# Altium schematic sheet io_0.schdoc
size 376 x 299 mm; Device: A_Customize; Symbol: A_Customize; Name: A_Customize; @Project Name: Odin; REV: 1.0; Date: 2024-10-02; Sheet: 1/1; Draw By: hsinr; Company: Your Company; Convert to PCB: yes; Add into BOM: yes; @Page No: 5; @Page Count: 9; @Schematic Name: Odin; @Board Name: Odin_V1.0.0; @Update Date: 2025-12-16; @Create Time: 19:52:40; @Update Time: 15:30:47; @Page Name: io_0; @Create Date: 2025-02-28
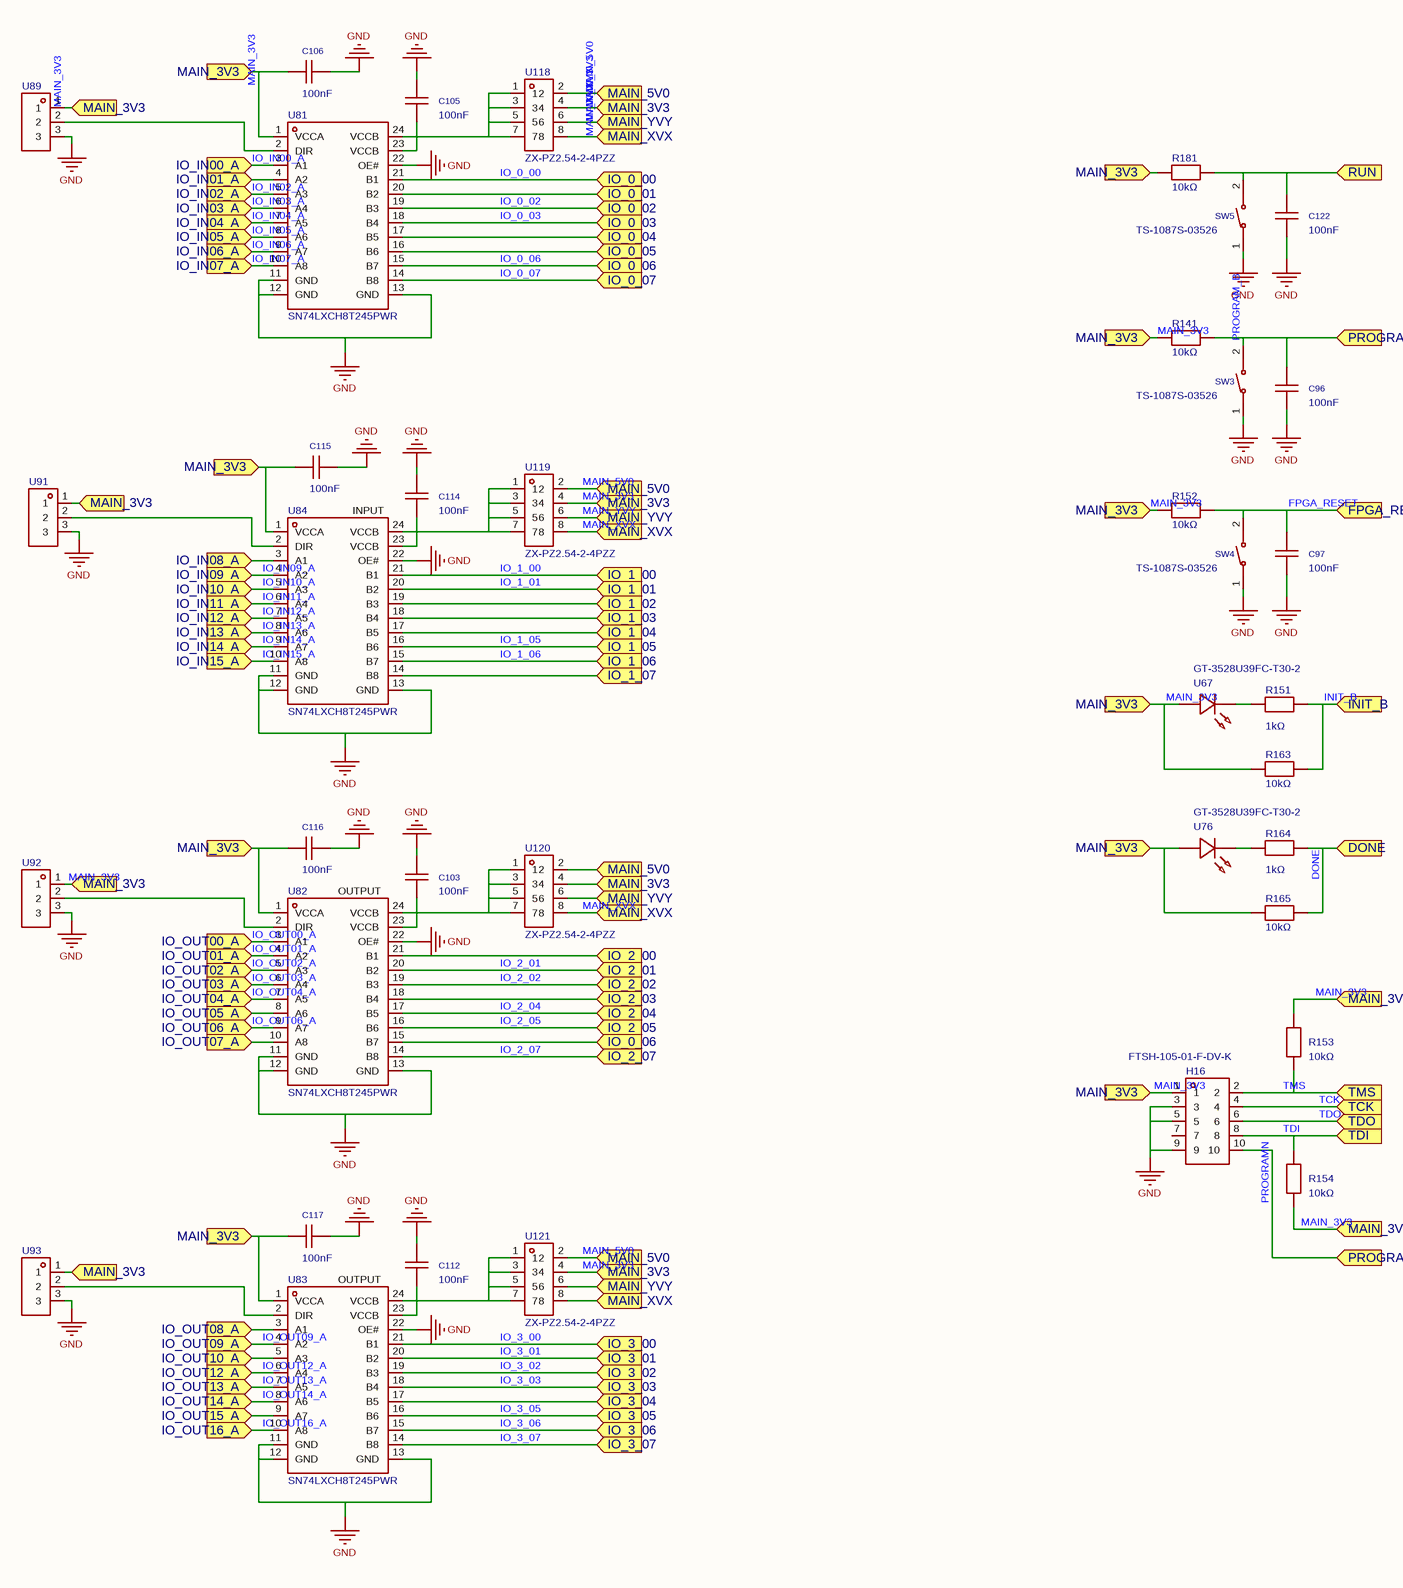
[diagram p0: io_0.schdoc]

## Parts
C96  100nF  [C0603]
C97  100nF  [C0603]
C103  100nF  [C0603]
C105  100nF  [C0603]
C106  100nF  [C0603]
C112  100nF  [C0603]
C114  100nF  [C0603]
C115  100nF  [C0603]
C116  100nF  [C0603]
C117  100nF  [C0603]
C122  100nF  [C0603]
H16  FTSH-105-01-F-DV-K  [HDR-SMD_FTSH-105-01-F-DV-K]
R141  10kΩ  [R0402]
R151  1kΩ  [R0402]
R152  10kΩ  [R0402]
R153  10kΩ  [R0402]
R154  10kΩ  [R0402]
R163  10kΩ  [R0402]
R164  1kΩ  [R0402]
R165  10kΩ  [R0402]
R181  10kΩ  [R0402]
SW3  TS-1087S-03526  [SW-SMD_L5.2-W5.2-P3.70-LS6.4]
SW4  TS-1087S-03526  [SW-SMD_L5.2-W5.2-P3.70-LS6.4]
SW5  TS-1087S-03526  [SW-SMD_L5.2-W5.2-P3.70-LS6.4]
U67  GT-3528U39FC-T30-2  [LED-SMD_L3.2-W3.0-LS3.5-RD_GT-3528U39FC-T30-2]
U76  GT-3528U39FC-T30-2  [LED-SMD_L3.2-W3.0-LS3.5-RD_GT-3528U39FC-T30-2]
U81  SN74LXCH8T245PWR  [TSSOP-24_L7.8-W4.4-P0.65-LS6.4-BL]
U82  SN74LXCH8T245PWR  [TSSOP-24_L7.8-W4.4-P0.65-LS6.4-BL]
U83  SN74LXCH8T245PWR  [TSSOP-24_L7.8-W4.4-P0.65-LS6.4-BL]
U84  SN74LXCH8T245PWR  [TSSOP-24_L7.8-W4.4-P0.65-LS6.4-BL]
U89  PH2.54-01-03PZD  [HDR-TH_3P-P2.54-V-M]  (value not drawn)
U91  PH2.54-01-03PZD  [HDR-TH_3P-P2.54-V-M]  (value not drawn)
U92  PH2.54-01-03PZD  [HDR-TH_3P-P2.54-V-M]  (value not drawn)
U93  PH2.54-01-03PZD  [HDR-TH_3P-P2.54-V-M]  (value not drawn)
U118  ZX-PZ2.54-2-4PZZ  [HDR-TH_8P-P2.54-V-M-R2-C4-S2.54]
U119  ZX-PZ2.54-2-4PZZ  [HDR-TH_8P-P2.54-V-M-R2-C4-S2.54]
U120  ZX-PZ2.54-2-4PZZ  [HDR-TH_8P-P2.54-V-M-R2-C4-S2.54]
U121  ZX-PZ2.54-2-4PZZ  [HDR-TH_8P-P2.54-V-M-R2-C4-S2.54]

## Ports
DONE (in), FPGA_RESET (in), INIT_B (in), IO_0_00 (in), IO_0_01 (in), IO_0_02 (in), IO_0_03 (in), IO_0_04 (in), IO_0_05 (in), IO_0_06 (in), IO_0_07 (in), IO_1_00 (in), IO_1_01 (in), IO_1_02 (in), IO_1_03 (in), IO_1_04 (in), IO_1_05 (in), IO_1_06 (in), IO_1_07 (in), IO_2_00 (in), IO_2_01 (in), IO_2_02 (in), IO_2_03 (in), IO_2_04 (in), IO_2_05 (in), IO_2_07 (in), IO_3_00 (in), IO_3_01 (in), IO_3_02 (in), IO_3_03 (in), IO_3_04 (in), IO_3_05 (in), IO_3_06 (in), IO_3_07 (in), IO_IN00_A (in), IO_IN01_A (in), IO_IN02_A (in), IO_IN03_A (in), IO_IN04_A (in), IO_IN05_A (in), IO_IN06_A (in), IO_IN07_A (in), IO_IN08_A (in), IO_IN09_A (in), IO_IN10_A (in), IO_IN11_A (in), IO_IN12_A (in), IO_IN13_A (in), IO_IN14_A (in), IO_IN15_A (in), IO_OUT00_A (in), IO_OUT01_A (in), IO_OUT02_A (in), IO_OUT03_A (in), IO_OUT04_A (in), IO_OUT05_A (in), IO_OUT06_A (in), IO_OUT07_A (in), IO_OUT08_A (in), IO_OUT09_A (in), IO_OUT10_A (in), IO_OUT12_A (in), IO_OUT13_A (in), IO_OUT14_A (in), IO_OUT15_A (in), IO_OUT16_A (in), MAIN_3V3 (in), MAIN_5V0 (in), MAIN_XVX (in), MAIN_YVY (in), PROGRAM_B (in), PROGRAMN (in), RUN (in), TCK (in), TDI (in), TDO (in), TMS (in)

## Nets
GND: C96.1 C97.1 C103.2 C105.2 C106.2 C112.2 C114.2 C115.2 C116.2 C117.2 C122.1 H16.3 H16.5 H16.9 SW3.1 SW4.1 SW5.1 U81.11(GND) U81.12(GND) U81.13(GND) U81.22(OE#) U82.11(GND) U82.12(GND) U82.13(GND) U82.22(OE#) U83.11(GND) U83.12(GND) U83.13(GND) U83.22(OE#) U84.11(GND) U84.12(GND) U84.13(GND) U84.22(OE#) U89.3 U91.3 U92.3 U93.3
DONE: R164.1 R165.1 ; port DONE
FPGA_RESET: C97.2 R152.2 SW4.2 ; port FPGA_RESET
INIT_B: R151.1 R163.1 ; port INIT_B
IO_0_00: U81.21(B1) ; port IO_0_00
IO_0_01: U81.20(B2) ; port IO_0_01
IO_0_02: U81.19(B3) ; port IO_0_02
IO_0_03: U81.18(B4) ; port IO_0_03
IO_0_04: U81.17(B5) ; port IO_0_04
IO_0_05: U81.16(B6) ; port IO_0_05
IO_0_06: U81.15(B7) U82.15(B7) ; port IO_0_06
IO_0_07: U81.14(B8) ; port IO_0_07
IO_1_00: U84.21(B1) ; port IO_1_00
IO_1_01: U84.20(B2) ; port IO_1_01
IO_1_02: U84.19(B3) ; port IO_1_02
IO_1_03: U84.18(B4) ; port IO_1_03
IO_1_04: U84.17(B5) ; port IO_1_04
IO_1_05: U84.16(B6) ; port IO_1_05
IO_1_06: U84.15(B7) ; port IO_1_06
IO_1_07: U84.14(B8) ; port IO_1_07
IO_2_00: U82.21(B1) ; port IO_2_00
IO_2_01: U82.20(B2) ; port IO_2_01
IO_2_02: U82.19(B3) ; port IO_2_02
IO_2_03: U82.18(B4) ; port IO_2_03
IO_2_04: U82.17(B5) ; port IO_2_04
IO_2_05: U82.16(B6) ; port IO_2_05
IO_2_07: U82.14(B8) ; port IO_2_07
IO_3_00: U83.21(B1) ; port IO_3_00
IO_3_01: U83.20(B2) ; port IO_3_01
IO_3_02: U83.19(B3) ; port IO_3_02
IO_3_03: U83.18(B4) ; port IO_3_03
IO_3_04: U83.17(B5) ; port IO_3_04
IO_3_05: U83.16(B6) ; port IO_3_05
IO_3_06: U83.15(B7) ; port IO_3_06
IO_3_07: U83.14(B8) ; port IO_3_07
IO_IN00_A: U81.3(A1) ; port IO_IN00_A
IO_IN01_A: U81.4(A2) ; port IO_IN01_A
IO_IN02_A: U81.5(A3) ; port IO_IN02_A
IO_IN03_A: U81.6(A4) ; port IO_IN03_A
IO_IN04_A: U81.7(A5) ; port IO_IN04_A
IO_IN05_A: U81.8(A6) ; port IO_IN05_A
IO_IN06_A: U81.9(A7) ; port IO_IN06_A
IO_IN07_A: U81.10(A8) ; port IO_IN07_A
IO_IN08_A: U84.3(A1) ; port IO_IN08_A
IO_IN09_A: U84.4(A2) ; port IO_IN09_A
IO_IN10_A: U84.5(A3) ; port IO_IN10_A
IO_IN11_A: U84.6(A4) ; port IO_IN11_A
IO_IN12_A: U84.7(A5) ; port IO_IN12_A
IO_IN13_A: U84.8(A6) ; port IO_IN13_A
IO_IN14_A: U84.9(A7) ; port IO_IN14_A
IO_IN15_A: U84.10(A8) ; port IO_IN15_A
IO_OUT00_A: U82.3(A1) ; port IO_OUT00_A
IO_OUT01_A: U82.4(A2) ; port IO_OUT01_A
IO_OUT02_A: U82.5(A3) ; port IO_OUT02_A
IO_OUT03_A: U82.6(A4) ; port IO_OUT03_A
IO_OUT04_A: U82.7(A5) ; port IO_OUT04_A
IO_OUT05_A: U82.8(A6) ; port IO_OUT05_A
IO_OUT06_A: U82.9(A7) ; port IO_OUT06_A
IO_OUT07_A: U82.10(A8) ; port IO_OUT07_A
IO_OUT08_A: U83.3(A1) ; port IO_OUT08_A
IO_OUT09_A: U83.4(A2) ; port IO_OUT09_A
IO_OUT10_A: U83.5(A3) ; port IO_OUT10_A
IO_OUT12_A: U83.6(A4) ; port IO_OUT12_A
IO_OUT13_A: U83.7(A5) ; port IO_OUT13_A
IO_OUT14_A: U83.8(A6) ; port IO_OUT14_A
IO_OUT15_A: U83.9(A7) ; port IO_OUT15_A
IO_OUT16_A: U83.10(A8) ; port IO_OUT16_A
MAIN_3V3: C106.1 C115.1 C116.1 C117.1 H16.1 R141.1 R152.1 R153.1 R154.2 R163.2 R165.2 R181.1 U67.1 U76.1 U81.1(VCCA) U82.1(VCCA) U83.1(VCCA) U84.1(VCCA) U89.1 U91.1 U92.1 U93.1 U118.4 U119.4 U120.4 U121.4 ; port MAIN_3V3
MAIN_5V0: U118.2 U119.2 U120.2 U121.2 ; port MAIN_5V0
MAIN_XVX: U118.8 U119.8 U120.8 U121.8 ; port MAIN_XVX
MAIN_YVY: U118.6 U119.6 U120.6 U121.6 ; port MAIN_YVY
PROGRAM_B: C96.2 R141.2 SW3.2 ; port PROGRAM_B
PROGRAMN: H16.10 ; port PROGRAMN
RUN: C122.2 R181.2 SW5.2 ; port RUN
TCK: H16.4 ; port TCK
TDI: H16.8 R154.1 ; port TDI
TDO: H16.6 ; port TDO
TMS: H16.2 R153.2 ; port TMS
NetC103_1: C103.1 U82.23(VCCB) U82.24(VCCB) U120.1 U120.3 U120.5 U120.7
NetC105_1: C105.1 U81.23(VCCB) U81.24(VCCB) U118.1 U118.3 U118.5 U118.7
NetC112_1: C112.1 U83.23(VCCB) U83.24(VCCB) U121.1 U121.3 U121.5 U121.7
NetC114_1: C114.1 U84.23(VCCB) U84.24(VCCB) U119.1 U119.3 U119.5 U119.7
NetR151_2: R151.2 U67.2
NetR164_2: R164.2 U76.2
NetU81_2: U81.2(DIR) U89.2
NetU82_2: U82.2(DIR) U92.2
NetU83_2: U83.2(DIR) U93.2
NetU84_2: U84.2(DIR) U91.2

Not connected (* = marked no-connect by the designer): H16 7

## Notes on the sheet
- (near U84) INPUT
- (near U82) OUTPUT
- (near U83) OUTPUT
- 1
- 2
- 3
- 4
- 5
- 6
- 7
- A
- B
- C
- D
- E
- TITLE:
- Odin
- Company:
- Your Company
- Sheet:
- REV:
- 1.0
- 1/1
- Date:
- 2024-10-02
- Drawn By:
- hsinr

## Library data of the parts
C96 C97 C103 C105 C106 C112 C114-C117 C122 = CL10B223KB8NNNC: Capacitance:22nF Tolerance:±10% Tolerance:±10% Voltage Rating:50V Temperature Coefficient:X7R; Manufacturer: SAMSUNG(三星); AddInBom: yes; ModelId: 624118aa3cc7497086c383c2d72e0852; ModelName: C0603_L1.6-W0.8-H0.8; ModelTransform: 62.992,31.496,0,0,0,0,0,0,0; Tolerance: ±10%; Voltage Rating: 50V; Temperature Coefficient: X7R; Symbol: CL10B223KB8NNNC; Value: 100nF; Device: CL10B223KB8NNNC; Supplier: LCSC; Manufacturer Part: CL10B223KB8NNNC; JLCPCB Part Class: Basic Part; LCSC Part Name: 22nF ±10% 50V; Supplier Footprint: 0603; Datasheet: https://item.szlcsc.com/datasheet/CL10B223KB8NNNC/21834.html; ConvertToPcb: yes; FootprintName: C0603
H16 = FTSH-105-01-F-DV-K: Pin Structure:2x5P Pitch:1.27mm Circluar Pins/Square Pins:Pin Header Mounting Type:Surface Mount,Vertical Number of Rows:2 Number of Pins:10P Length of Mating Pin:3.05mm Contact Material:Phosphor Bronze Contact Plating:Gold Operating Temperature:-55℃~+125; Manufacturer: SAMTEC; AddInBom: yes; Pin Structure: 2x5P; Pitch: 1.27mm; Symbol: FTSH-105-01-F-DV-K; Device: FTSH-105-01-F-DV-K; LCSC Part Name: 2x5P 间距:1.27mm 方针 立贴; SupplierPart: C5382952; ManufacturerPart: FTSH-105-01-F-DV-K; Supplier Footprint: SMD,P=1.27mm; JLCPCB Part Class: Extended Part; Datasheet: https://item.szlcsc.com/datasheet/FTSH-105-01-F-DV-K/6257093.html; Supplier: LCSC; ConvertToPcb: yes; FootprintName: HDR-SMD_FTSH-105-01-F-DV-K; Circluar Pins/Square Pins: Pin Header; Mounting Type: Surface Mount,Vertical; Number of Rows: 2; Number of Pins: 10P; Length of Mating Pin: 3.05mm; Contact Material: Phosphor Bronze; Contact Plating: Gold; Operating Temperature: -55℃~+125℃; Color: Black
R141 R151-R154 R163-R165 R181 = FRC0402F3002TS: Type:Thick Film Resistor Resistance:30kΩ Tolerance:±1% Tolerance:±1% Power(Watts):62.5mW Voltage-Supply(Max):50V Temperature Coefficient:±100ppm/℃ Temperature Coefficient:±100ppm/℃ Operating Temperature:-55℃~+155℃ Operating Temperature:-55℃~+155℃; Manufacturer: FOJAN(富捷); AddInBom: yes; ModelId: efdecb7dae4442949d28eecaf748420f; ModelName: R0402_L1.0-W0.5-H0.4; ModelTransform: 39.37,19.685,0,0,0,0,0,0,0; Tolerance: ±1%; Power(Watts): 62.5mW; Voltage-Supply(Max): 50V; Symbol: FRC0402F3002TS; Device: FRC0402F3002TS; LCSC Part Name: 30kΩ ±1% 62.5mW 厚膜电阻; ManufacturerPart: FRC0402F3002TS; Supplier Footprint: 0402; JLCPCB Part Class: Extended Part; Supplier: LCSC; ConvertToPcb: yes; FootprintName: R0402; Type: Thick Film Resistor; Temperature Coefficient: ±100ppm/℃; Operating Temperature: -55℃~+155℃
  R141 R152-R154 R163 R165 R181: Value: 10kΩ
  R151 R164: Value: 1kΩ
SW3-SW5 = TS-1087S-03526: Circuit:SPST Actuator Style:Round Button Mounting Style:Brick nogging Switch Length:5.2mm Switch Width:5.2mm Switch Height:3.5mm Contact Current:50mA Voltage Rating (DC):12V With Lamp:- Mechanical Life:-; Manufacturer: XUNPU(讯普); AddInBom: yes; ModelId: 2723734148c54955a536c213bd124217; ModelName: SW-SMD_L5.2-W5.2-H4.5-P3.70-LS6.4; ModelTransform: 251.968,204.724,0,0,0,0,0,0,0; Circuit: SPST; Switch Length: 5.2mm; Switch Height: 3.5mm; Contact Current: 50mA; Voltage Rating (DC): 12V; Symbol: TS-1087S-03526; Device: TS-1087S-03526; Supplier: LCSC; Supplier Part: C455271; Manufacturer Part: TS-1087S-03526; JLCPCB Part Class: Extended Part; LCSC Part Name: 5.2*5.2*3.5mm 立贴 轻触开关; Supplier Footprint: SMD,5.2x5.2mm; Datasheet: https://atta.szlcsc.com/upload/public/pdf/source/20191118/C455274_574AF48D0973B20F599903060160141E.pdf; ConvertToPcb: yes; FootprintName: SW-SMD_L5.2-W5.2-P3.70-LS6.4; Actuator Style: Round Button; Mounting Style: Brick nogging; Switch Width: 5.2mm; With Lamp: -; Mechanical Life: -
U67 U76 = GT-3528U39FC-T30-2: Illumination Color:Red Voltage - Forward(Vf):1.8V~2.4V Voltage - Forward(Vf):1.8V~2.4V Power(Watts):48mW Forward Current:20mA Wavelength - Dominant:618nm~627nm Wavelength - Dominant:618nm~627nm Diode Configuration:Discrete Diode Luminous Intensity:16000mc; Manufacturer: HONGLITRONIC(鸿利光电); AddInBom: yes; ModelId: 94143dd234c6457f8c2ff78e7d393229; ModelTransform: 137.795,118.11,0,180,0,0,0,-0.984,0; Illumination Color: Red; Power(Watts): 48mW; Forward Current: 20mA; Luminous Intensity: 16000mcd; Viewing Angle: 30°; Symbol: GT-3528U39FC-T30-2; Device: GT-3528U39FC-T30-2; LCSC Part Name: 3528两脚球头红光 30度; SupplierPart: C7471839; ManufacturerPart: GT-3528U39FC-T30-2; Supplier Footprint: 3528; JLCPCB Part Class: Extended Part; Datasheet: https://item.szlcsc.com/datasheet/GT-3528U39FC-T30-2/8528029.html; Supplier: LCSC; ConvertToPcb: yes; FootprintName: LED-SMD_L3.2-W3.0-LS3.5-RD_GT-3528U39FC-T30-2; ModelName: LED-SMD_L3.2-W3.0-LS3.5-RD_GT-3528U39FC-T30-2; Voltage - Forward(Vf): 1.8V~2.4V; Wavelength - Dominant: 618nm~627nm; Diode Configuration: Discrete Diode; Mounting Style: op View Mount; Operating Temperature: -30℃~+85℃
U81-U84 = SN74LXCH8T245PWR: Channel Type:Bidirectional Data Rate:420Mbps Voltage - Supply(VCCA):1.1V~5.5V Voltage - Supply(VCCA):1.1V~5.5V Voltage - Supply(VCCB):1.1V~5.5V Voltage - Supply(VCCB):1.1V~5.5V Number of Circuits:8 Output Type:Tri-State Operating Temperature:-40℃~+125℃ Op; Manufacturer: TI(德州仪器); AddInBom: yes; ModelId: 3ad29e76e90e413f9b5e5f57db7c305b; ModelName: TSSOP-24_L7.8-W4.4-H1.0-LS6.4-P0.65; ModelTransform: 252.188,307.086,0,90,0,0,0,0,0; Number of Circuits: 8; Symbol: SN74LXCH8T245PWR; Device: SN74LXCH8T245PWR; LCSC Part Name: 具有可配置电平转换的8位转换收发器; SupplierPart: C2918963; ManufacturerPart: SN74LXCH8T245PWR; Supplier Footprint: TSSOP-24(6.4x7.8); JLCPCB Part Class: Extended Part; Datasheet: https://www.ti.com/cn/lit/gpn/sn74lxch8t245; Supplier: LCSC; ConvertToPcb: yes; FootprintName: TSSOP-24_L7.8-W4.4-P0.65-LS6.4-BL; Channel Type: Bidirectional; Data Rate: 420Mbps; Voltage - Supply(VCCA): 1.1V~5.5V; Voltage - Supply(VCCB): 1.1V~5.5V; Output Type: Tri-State; Operating Temperature: -40℃~+125℃; Features: Power-Off Protection
U89 U91-U93 = PH2.54-01-03PZD: Pin Structure:1x3P Pitch:2.54mm Circluar Pins/Square Pins:Policy Mounting Type:Straight Number of Rows:Single Row Number of Pins:3P Length of Mating Pin:6mm Insulation Height:2.5mm Length of End Connection Pin:3mm Contact Material:Brass Operating Temperat; Manufacturer: XUNPU(讯普); AddInBom: yes; ModelId: af4b4ddffc754c809db3fbd10e5ce24c; ModelName: HDR-TH_3P-P2.54-M-LI-1X3P; ModelTransform: 299.9994,100,0,0,0,0,0,0,-118.11; Pin Structure: 1x3P; Pitch: 2.54mm; Circluar Pins/Square Pins: Policy; Symbol: PH2.54-01-03PZD; Device: PH2.54-01-03PZD; LCSC Part Name: 1x3P 间距:2.54mm 方针 直插; SupplierPart: C7501581; ManufacturerPart: PH2.54-01-03PZD; Supplier Footprint: 插件,P=2.54mm; JLCPCB Part Class: Extended Part; Datasheet: https://atta.szlcsc.com/upload/public/pdf/source/20230815/30A24B1E4B9BDE2239C7F8E56770F33B.pdf; Supplier: LCSC; ConvertToPcb: yes; FootprintName: HDR-TH_3P-P2.54-V-M; Mounting Type: Straight; Number of Rows: Single Row; Number of Pins: 3P; Length of Mating Pin: 6mm; Insulation Height: 2.5mm; Length of End Connection Pin: 3mm; Contact Material: Brass; Operating Temperature: -40℃~+105℃; Color: Black
U118-U121 = ZX-PZ2.54-2-4PZZ: Pin Structure:2x4P Pitch:2.54mm Row Spacing:2.54mm Circluar Pins/Square Pins:Pin Header Mounting Type:Through Hole Number of Rows:2 Number of Pins:8P Current Rating:3A Voltage Rating (Max):1kV Length of Mating Pin:6mm Insulation Height:2.5mm Length of End; Manufacturer: Megastar(兆星); AddInBom: yes; ModelId: 47b5ce995b664298ab05f1b74b77106f; ModelName: HDR-TH_8P-P2.54-M-LI-2X4P; ModelTransform: 399.999,200,0,0,0,0,0,0,-118.11; Pin Structure: 2x4P; Pitch: 2.54mm; Current Rating: 3A; Voltage Rating (Max): 1kV; Symbol: ZX-PZ2.54-2-4PZZ; Device: ZX-PZ2.54-2-4PZZ; LCSC Part Name: 2x4P 间距:2.54mm 方针 直插; SupplierPart: C7501275; ManufacturerPart: ZX-PZ2.54-2-4PZZ; Supplier Footprint: 插件,P=2.54mm; JLCPCB Part Class: Extended Part; Datasheet: https://item.szlcsc.com/datasheet/ZX-PZ2.54-2-4PZZ/8582488.html; Supplier: LCSC; ConvertToPcb: yes; FootprintName: HDR-TH_8P-P2.54-V-M-R2-C4-S2.54; Row Spacing: 2.54mm; Circluar Pins/Square Pins: Pin Header; Mounting Type: Through Hole; Number of Rows: 2; Number of Pins: 8P; Length of Mating Pin: 6mm; Insulation Height: 2.5mm; Length of End Connection Pin: 3mm; Contact Material: Brass; Contact Plating: Gold; Operating Temperature: -40℃~+105℃; Color: Black